# EAGLE design OSC1 (EAGLE 7.4.0)
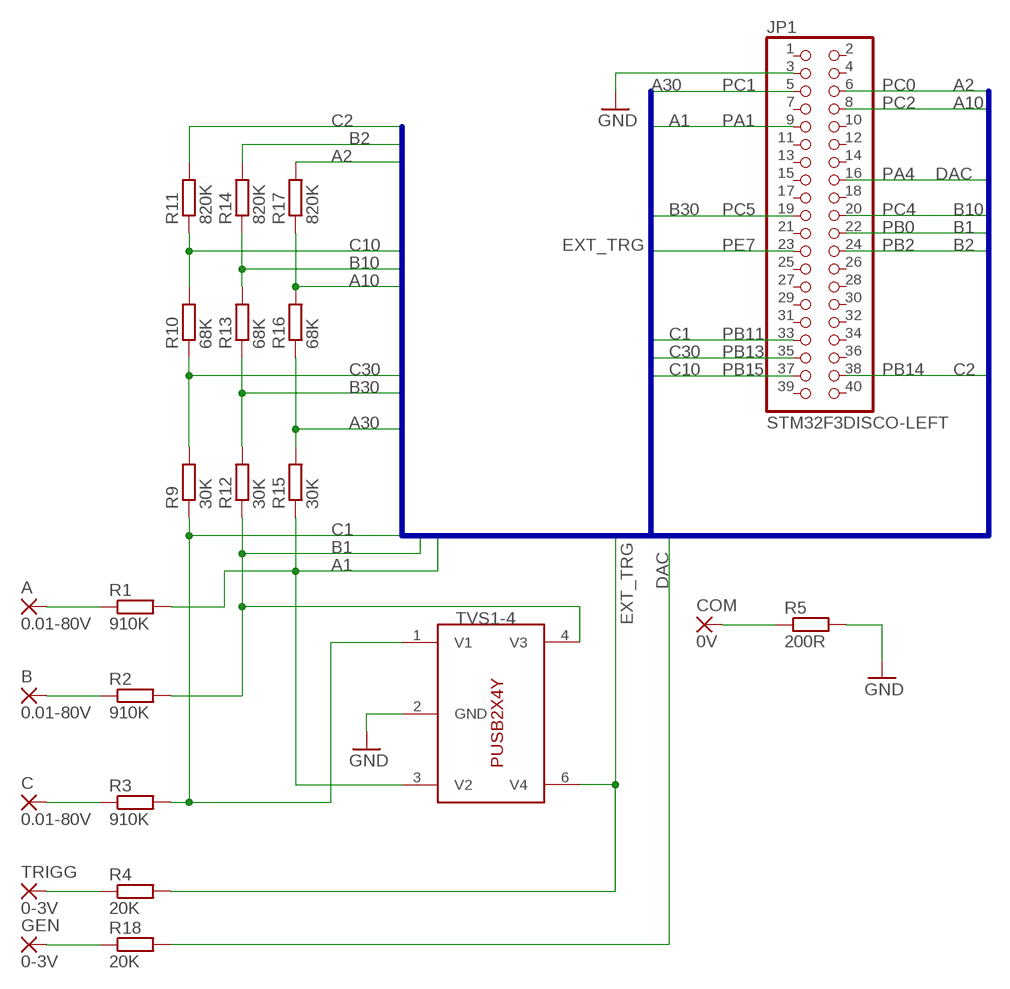
[diagram p0: schematic, sheet 1]

## Parts
A  0.01-80V  2,54/0,8  [2,54/0,8]
B  0.01-80V  2,54/0,8  [2,54/0,8]
C  0.01-80V  2,54/0,8  [2,54/0,8]
COM  0V  2,54/0,8  [2,54/0,8]
GEN  0-3V  2,54/0,8  [2,54/0,8]
JP1  STM32F3DISCO-LEFT  PINHD-2X20  [2X20]
R1  910K  R-EU_R1206  [R1206]
R2  910K  R-EU_R1206  [R1206]
R3  910K  R-EU_R1206  [R1206]
R4  20K  R-EU_R1206  [R1206]
R5  200R  R-EU_R1206  [R1206]
R9  30K  R-EU_R1206  [R1206]
R10  68K  R-EU_R1206  [R1206]
R11  820K  R-EU_R1206  [R1206]
R12  30K  R-EU_R1206  [R1206]
R13  68K  R-EU_R1206  [R1206]
R14  820K  R-EU_R1206  [R1206]
R15  30K  R-EU_R1206  [R1206]
R16  68K  R-EU_R1206  [R1206]
R17  820K  R-EU_R1206  [R1206]
R18  20K  R-EU_R1206  [R1206]
TRIGG  0-3V  2,54/0,8  [2,54/0,8]
TVS1-4  PUSB2X4Y  [SOT363_PHILIPS]

## Nets
A1: JP1.9 R1.2 R15.1 TVS1-4.3(V2)
A2: JP1.6 R17.2
A10: JP1.8 R16.2 R17.1
A30: JP1.5 R15.2 R16.1
B1: JP1.22 R2.2 R12.1 TVS1-4.4(V3)
B2: JP1.24 R14.2
B10: JP1.20 R13.2 R14.1
B30: JP1.19 R12.2 R13.1
C1: JP1.33 R3.2 R9.1 TVS1-4.1(V1)
C2: JP1.38 R11.2
C10: JP1.37 R10.2 R11.1
C30: JP1.35 R9.2 R10.1
DAC: JP1.16 R18.2
EXT_TRG: JP1.23 R4.2 TVS1-4.6(V4)
GND: JP1.3 R5.2 TVS1-4.2(GND)
N$1: COM.1(P) R5.1
N$3: A.1(P) R1.1
N$5: R4.1 TRIGG.1(P)
N$7: C.1(P) R3.1
N$9: B.1(P) R2.1
N$19: GEN.1(P) R18.1
Unconnected: JP1.1 JP1.2 JP1.4 JP1.7 JP1.10 JP1.11 JP1.12 JP1.13 JP1.14 JP1.15 JP1.17 JP1.18 JP1.21 JP1.25 JP1.26 JP1.27 JP1.28 JP1.29 JP1.30 JP1.31 JP1.32 JP1.34 JP1.36 JP1.39 JP1.40

## Buses
A1,A2,A10,A30,B1,B2,B10,B30,C1,C2,C10,C30,EXT_TRG,DAC

## Notes on the sheet
- PC1 | PC0
- PC2
- PA1
- PA4
- PC5 | PC4
- PB0
- PE7 | PB2
- PB11
- PB13
- PB15 | PB14

## Library data of the parts
A B C COM GEN TRIGG = wirepad:2,54/0,8: THROUGH-HOLE PAD
JP1 = pinhead:PINHD-2X20: PIN HEADER
R1-R5 R9-R18 = rcl:R-EU_: RESISTOR, European symbol
TVS1-4 = oscill:PUSB2X4Y: PUSB2X4Y ESD protection for high-speed interfaces clamping 3.8V 4 inputs

## Board
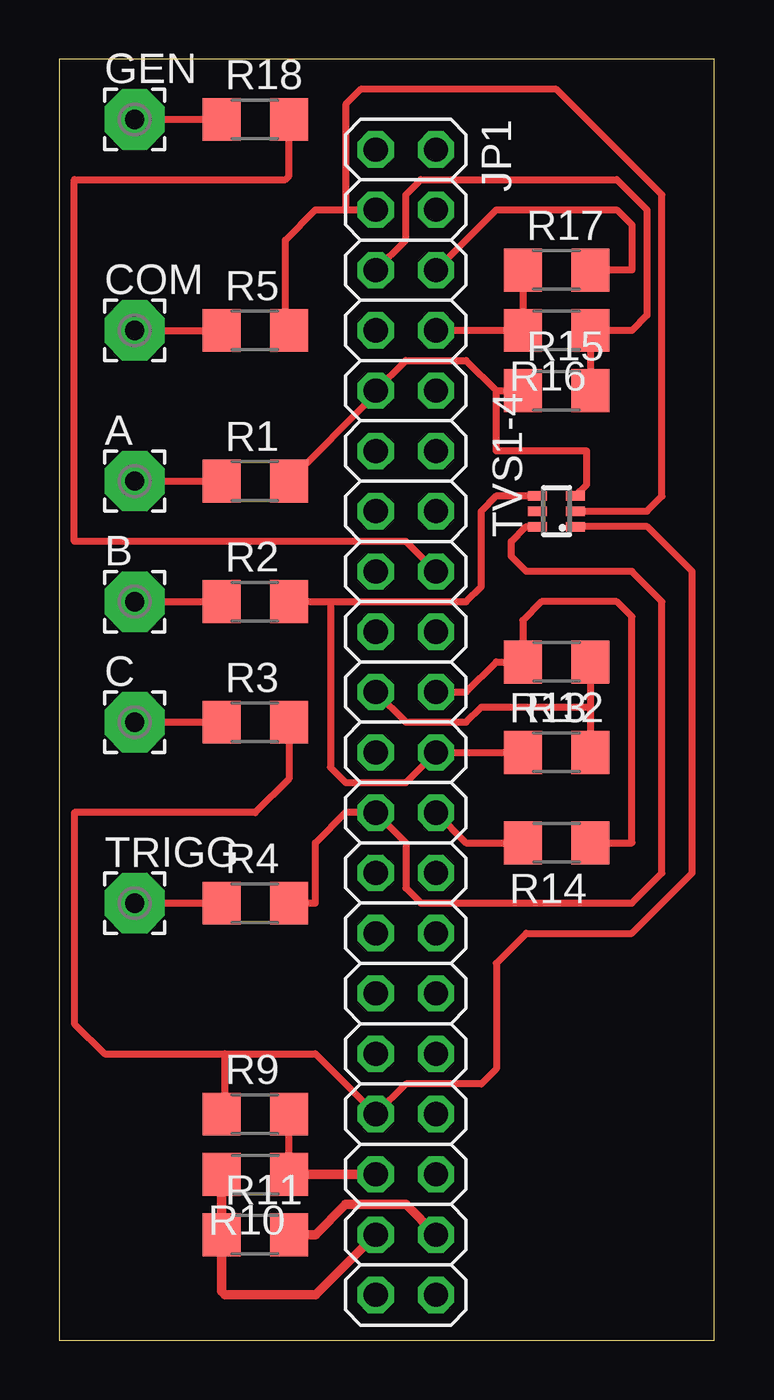
[diagram p1: board, top side]

Size 27.61 x 53.97 mm. Coordinates in mm from the lower left corner, seen from the top.
Outline: 0,0 27.61,0 27.61,53.97 0,53.97 0,0
Copper layers (1*16): Top 0.0356mm / dielectric 1.5011mm / Bottom 0.0356mm
Design rules "LaenPCBOrder(oshpark) *": minimum track width 6mil, minimum drill 13mil, track to track 6mil, track to pad 6mil, pad to pad 6mil, via to via 6mil, smd to smd 6mil, copper to edge 15mil, drill to drill 6mil, minimum pad ring 7mil, minimum via ring 7mil, stop-mask expansion 3mil, vias tented up to drill 0mil, thermal gap 10mil

### Footprints (pad centres in the part's own frame; a part is rotated, then mirrored left to right if it is on the bottom)
2,54/0,8 = drill 0.813 pad 2.54 octagon: 1 0,0
2X20 = drill 1.016 octagon: 1 -24.13,-1.27; 2 -24.13,1.27; 3 -21.59,-1.27; 4 -21.59,1.27; 5 -19.05,-1.27; 6 -19.05,1.27; 7 -16.51,-1.27; 8 -16.51,1.27; 9 -13.97,-1.27; 10 -13.97,1.27; 11 -11.43,-1.27; 12 -11.43,1.27; 13 -8.89,-1.27; 14 -8.89,1.27; 15 -6.35,-1.27; 16 -6.35,1.27; 17 -3.81,-1.27; 18 -3.81,1.27; 19 -1.27,-1.27; 20 -1.27,1.27; 21 1.27,-1.27; 22 1.27,1.27; 23 3.81,-1.27; 24 3.81,1.27; 25 6.35,-1.27; 26 6.35,1.27; 27 8.89,-1.27; 28 8.89,1.27; 29 11.43,-1.27; 30 11.43,1.27; 31 13.97,-1.27; 32 13.97,1.27; 33 16.51,-1.27; 34 16.51,1.27; 35 19.05,-1.27; 36 19.05,1.27; 37 21.59,-1.27; 38 21.59,1.27; 39 24.13,-1.27; 40 24.13,1.27
R1206 = smd 1.6 x 1.803: 1 -1.422,0; 2 1.422,0
SOT363_PHILIPS = smd 0.4 x 0.8: 1 -0.65,-0.8; 2 0,-0.8; 3 0.65,-0.8; 4 0.65,0.8; 5 0,0.8; 6 -0.65,0.8

### Placement (x,y rotation side)
A  3.17,36.2 0 top
B  3.17,31.11 0 top
C  3.17,26.04 0 top
COM  3.17,42.55 0 top
GEN  3.17,51.44 0 top
JP1  14.61,26.04 270 top
R1  8.26,36.2 0 top
R2  8.26,31.11 0 top
R3  8.26,26.04 0 top
R4  8.26,18.41 0 top
R5  8.26,42.55 0 top
R9  8.26,9.53 0 top
R10  8.26,6.99 180 top
R11  8.26,4.45 0 top
R12  20.95,24.77 0 top
R13  20.95,28.57 180 top
R14  20.95,20.95 180 top
R15  20.95,40.01 0 top
R16  20.95,42.55 180 top
R17  20.95,45.09 0 top
R18  8.26,51.44 0 top
TRIGG  3.17,18.41 0 top
TVS1-4  20.95,34.92 90 top

### Tracks (layer width: path | path; a pad name or v marks a point on that pad's centre or on a via)
A1
  Top 0.305: R1.2 13.34,39.85 JP1.9 14.61,41.27 17.14,41.27 18.41,40.01 | 18.41,40.01 R15.1 | TVS1-4.3 22.23,36.05 22.23,37.47 18.41,37.47 18.41,40.01
A2
  Top 0.305: JP1.6 18.41,47.62 23.5,47.62 24.13,46.99 24.13,45.09 R17.2
A10
  Top 0.305: R17.1 R16.2 JP1.8
A30
  Top 0.305: R15.2 R16.1 24.13,42.55 24.77,43.18 24.77,47.62 23.5,48.9 15.24,48.9 14.61,48.26 14.61,46.35 JP1.5
B1
  Top 0.305: 11.43,31.11 11.43,24.13 12.06,23.5 14.61,23.5 JP1.22 R12.1 | R2.2 11.43,31.11 | 11.43,31.11 17.14,31.11 17.78,31.75 17.78,34.92 18.43,35.58 TVS1-4.4
B2
  Top 0.305: JP1.24 17.14,20.95 R14.2
B10
  Top 0.305: JP1.20 17.14,27.3 18.41,28.57 R13.2 19.53,30.33 20.32,31.11 23.5,31.11 24.13,30.48 24.13,20.95 R14.1
B30
  Top 0.305: R13.1 22.38,26.67 | 22.38,26.67 R12.2 | JP1.19 14.61,26.04 17.14,26.04 17.78,26.67 22.38,26.67
C1
  Top 0.305: R9.1 6.99,9.53 6.99,12.06 | 6.99,12.06 10.79,12.06 JP1.33 14.61,10.79 17.78,10.79 18.41,11.43 18.41,15.88 19.68,17.14 24.13,17.14 26.67,19.68 26.67,32.38 24.78,34.27 TVS1-4.1 21.77,34.29 | R3.2 9.68,23.65 8.26,22.23 0.64,22.23 0.64,13.34 1.91,12.06 6.99,12.06
C2
  Top 0.406: R11.2 10.79,4.45 12.06,5.71 14.61,5.71 JP1.38
C10
  Top 0.406: R10.2 R11.1 6.83,2.06 6.99,1.91 10.79,1.91 JP1.37
C30
  Top 0.305: R10.1 R9.2
  Top 0.406: R10.1 JP1.35
DAC
  Top 0.305: JP1.16 14.61,33.66 0.64,33.66 0.64,48.9 9.53,48.9 9.68,49.05 R18.2
EXT_TRG
  Top 0.305: 9.53,18.41 R4.2 10.79,18.41 10.79,20.95 12.06,22.23 JP1.23 14.61,20.95 14.61,19.05 15.24,18.41 24.13,18.41 25.4,19.68 25.4,31.11 24.13,32.38 19.68,32.38 19.05,33.02 19.05,33.66 19.67,34.27 TVS1-4.6
GND
  Top 0.305: R5.2 9.53,42.7 9.53,46.35 10.79,47.62 12.06,47.62 | 12.06,47.62 JP1.3 | TVS1-4.2 24.77,34.92 25.4,35.56 25.4,48.26 20.95,52.7 12.7,52.7 12.06,52.07 12.06,47.62
N$1
  Top 0.305: COM.1 R5.1
N$3
  Top 0.305: A.1 R1.1
N$5
  Top 0.305: TRIGG.1 R4.1
N$7
  Top 0.305: C.1 R3.1
N$9
  Top 0.305: B.1 R2.1
N$19
  Top 0.305: GEN.1 R18.1